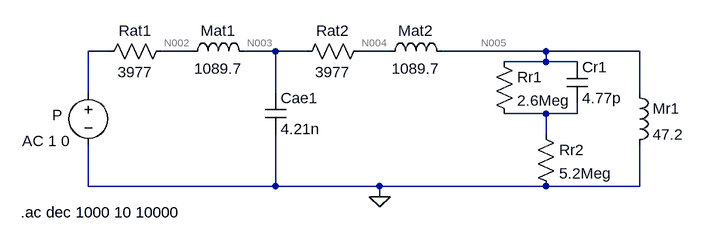
[diagram p0: schematic muffler.asc]
muffler.asc, the LTspice schematic file:
Version 4
SHEET 1 924 680
WIRE 32 112 0 112
WIRE 160 112 112 112
WIRE 288 112 240 112
WIRE 336 112 288 112
WIRE 464 112 416 112
WIRE 704 112 544 112
WIRE 848 112 704 112
WIRE 704 128 704 112
WIRE 704 128 640 128
WIRE 752 128 704 128
WIRE 0 176 0 112
WIRE 288 176 288 112
WIRE 848 176 848 112
WIRE 704 208 640 208
WIRE 752 208 752 192
WIRE 752 208 704 208
WIRE 704 240 704 208
WIRE 0 320 0 256
WIRE 288 320 288 240
WIRE 288 320 0 320
WIRE 448 320 288 320
WIRE 704 320 448 320
WIRE 848 320 848 256
WIRE 848 320 704 320
WIRE 448 336 448 320
FLAG 448 336 0
SYMBOL voltage 0 160 R0
WINDOW 0 -48 50 Center 2
WINDOW 123 -102 90 Left 2
WINDOW 39 0 0 Left 0
SYMATTR InstName P
SYMATTR Value ""
SYMATTR Value2 AC 1 0
SYMBOL res 128 96 R90
WINDOW 0 0 56 VBottom 2
WINDOW 3 32 56 VTop 2
SYMATTR InstName Rat1
SYMATTR Value 3977
SYMBOL ind 144 128 R270
WINDOW 0 32 56 VTop 2
WINDOW 3 5 56 VBottom 2
SYMATTR InstName Mat1
SYMATTR Value 1089.7
SYMBOL cap 272 176 R0
SYMATTR InstName Cae1
SYMATTR Value 4.21n
SYMBOL res 432 96 R90
WINDOW 0 0 56 VBottom 2
WINDOW 3 32 56 VTop 2
SYMATTR InstName Rat2
SYMATTR Value 3977
SYMBOL ind 448 128 R270
WINDOW 0 32 56 VTop 2
WINDOW 3 5 56 VBottom 2
SYMATTR InstName Mat2
SYMATTR Value 1089.7
SYMBOL res 624 112 R0
SYMATTR InstName Rr1
SYMATTR Value 2.6Meg
SYMBOL res 688 224 R0
SYMATTR InstName Rr2
SYMATTR Value 5.2Meg
SYMBOL cap 736 128 R0
SYMATTR InstName Cr1
SYMATTR Value 4.77p
SYMBOL ind 832 160 R0
SYMATTR InstName Mr1
SYMATTR Value 47.2
TEXT -104 360 Left 2 !.ac dec 1000 10 10000

The netlist it stands for:
* muffler.asc
V§P N001 0 AC 1 0
Rat1 N002 N001 3977
L§Mat1 N002 N003 1089.7
Cae1 N003 0 4.21n
Rat2 N004 N003 3977
L§Mat2 N004 N005 1089.7
Rr1 N005 N006 2.6Meg
Rr2 N006 0 5.2Meg
Cr1 N005 N006 4.77p
L§Mr1 N005 0 47.2
.ac dec 1000 10 10000
.backanno
.end

* Results of the author's LTspice run, read from the files saved beside the schematic
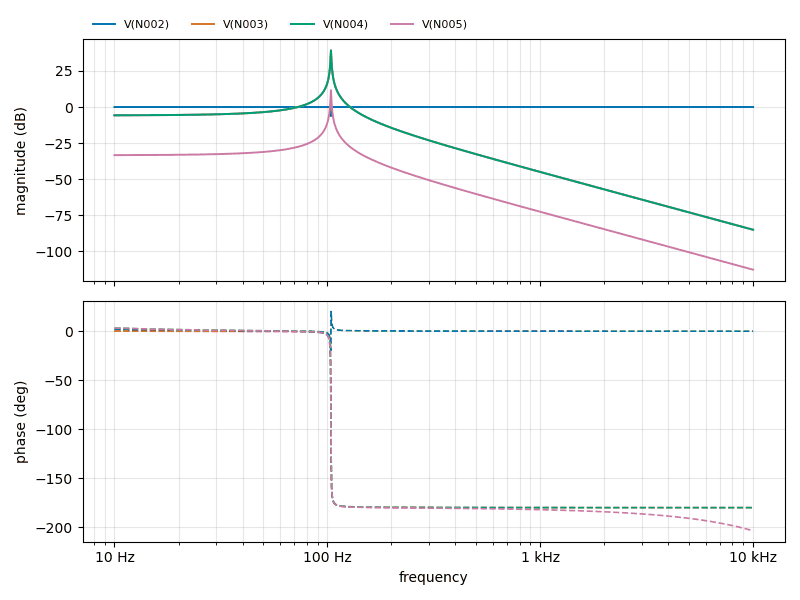
[diagram p1: AC Analysis of muffler.asc, plotted from the saved traces]
* AC Analysis, 1 run:
*   V(N002): -0.01 dB at 10 Hz, -0.00 dB at 10 kHz, peak -0.00 dB at 10 kHz, 3 dB below the peak at 104.2 Hz
*   V(N003): -5.76 dB at 10 Hz, -85.16 dB at 10 kHz, peak 39.27 dB at 104 Hz, 3 dB below the peak at 103.7 Hz and 104.3 Hz
*   V(N004): -5.77 dB at 10 Hz, -85.16 dB at 10 kHz, peak 39.27 dB at 104 Hz, 3 dB below the peak at 103.7 Hz and 104.3 Hz
*   V(N005): -33.41 dB at 10 Hz, -112.88 dB at 10 kHz, peak 11.64 dB at 104 Hz, 3 dB below the peak at 103.7 Hz and 104.3 Hz